# Altium schematic sheet SS34.schdoc
size 49 x 29 mm
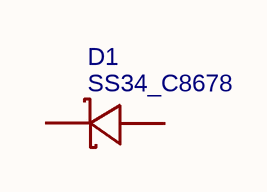
[diagram p0: SS34.schdoc]

## Parts
D1  SS34_C8678  [DO-214AC_L4.3-W2.7-LS5.3-RD]

## Nets

Not connected (* = marked no-connect by the designer): D1 1(K) 2(A)

## Library data of the parts
D1 = SS34_C8678: BOM_Manufacturer Part: SS34; BOM_Manufacturer: MDD; BOM_Supplier: LCSC; BOM_Supplier Part: C8678; BOM_JLCPCB Part Class: Basic Part; spicePre: D; spiceSymbolName: SS34_C8678